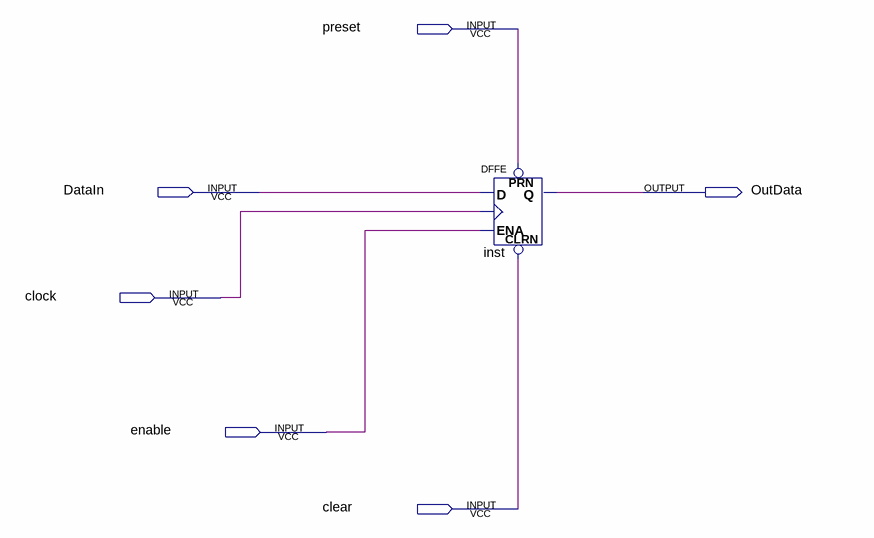
[diagram p0: schematic sheet]
// Quartus schematic reg1bit.bdf as structural Verilog: 1 symbols, 6 pins
module reg1bit (
  input  preset,
  input  DataIn,
  input  clock,
  input  enable,
  input  clear,
  output OutData
);

  DFFE inst (.PRN(preset), .CLRN(clear), .D(DataIn), .CLK(clock), .ENA(enable), .Q(OutData));
endmodule
